# Altium schematic sheet 01_Main.SchDoc
size 594 x 420 mm; SheetNumber: 1; SheetTotal: 5
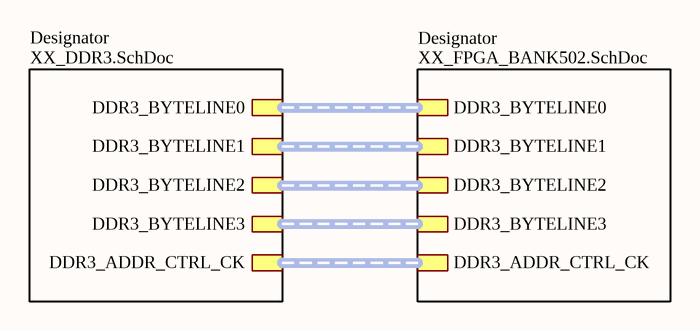
[diagram p0: 01_Main.SchDoc]

## Sub-sheets
Designator = XX_DDR3.SchDoc: DDR3_BYTELINE0 (harness DDR3_BYTELINE0), DDR3_BYTELINE1 (harness DDR3_BYTELINE1), DDR3_BYTELINE2 (harness DDR3_BYTELINE2), DDR3_BYTELINE3 (harness DDR3_BYTELINE3), DDR3_ADDR_CTRL_CK (harness DDR3_ADDR_CTRL_CK)
Designator = XX_FPGA_BANK502.SchDoc: DDR3_BYTELINE0 (harness DDR3_BYTELINE0), DDR3_BYTELINE1 (harness DDR3_BYTELINE1), DDR3_BYTELINE2 (harness DDR3_BYTELINE2), DDR3_BYTELINE3 (harness DDR3_BYTELINE3), DDR3_ADDR_CTRL_CK (harness DDR3_ADDR_CTRL_CK)

## Notes on the sheet
- Перв. примен.
- Справ. №
- Подп. и дата
- Инв. № дубл.
- Взам. инв. №
- Разраб.
- Изм.
- Лист
- № докум.
- Подп.
- Дата
- Лит.
- Масса
- Масштаб
- Пров.
- Т.контр.
- Листов
- Инв. № подл.
- Утв.
- Н.контр.
- 2.106-A2
- Копировал
- Формат А2